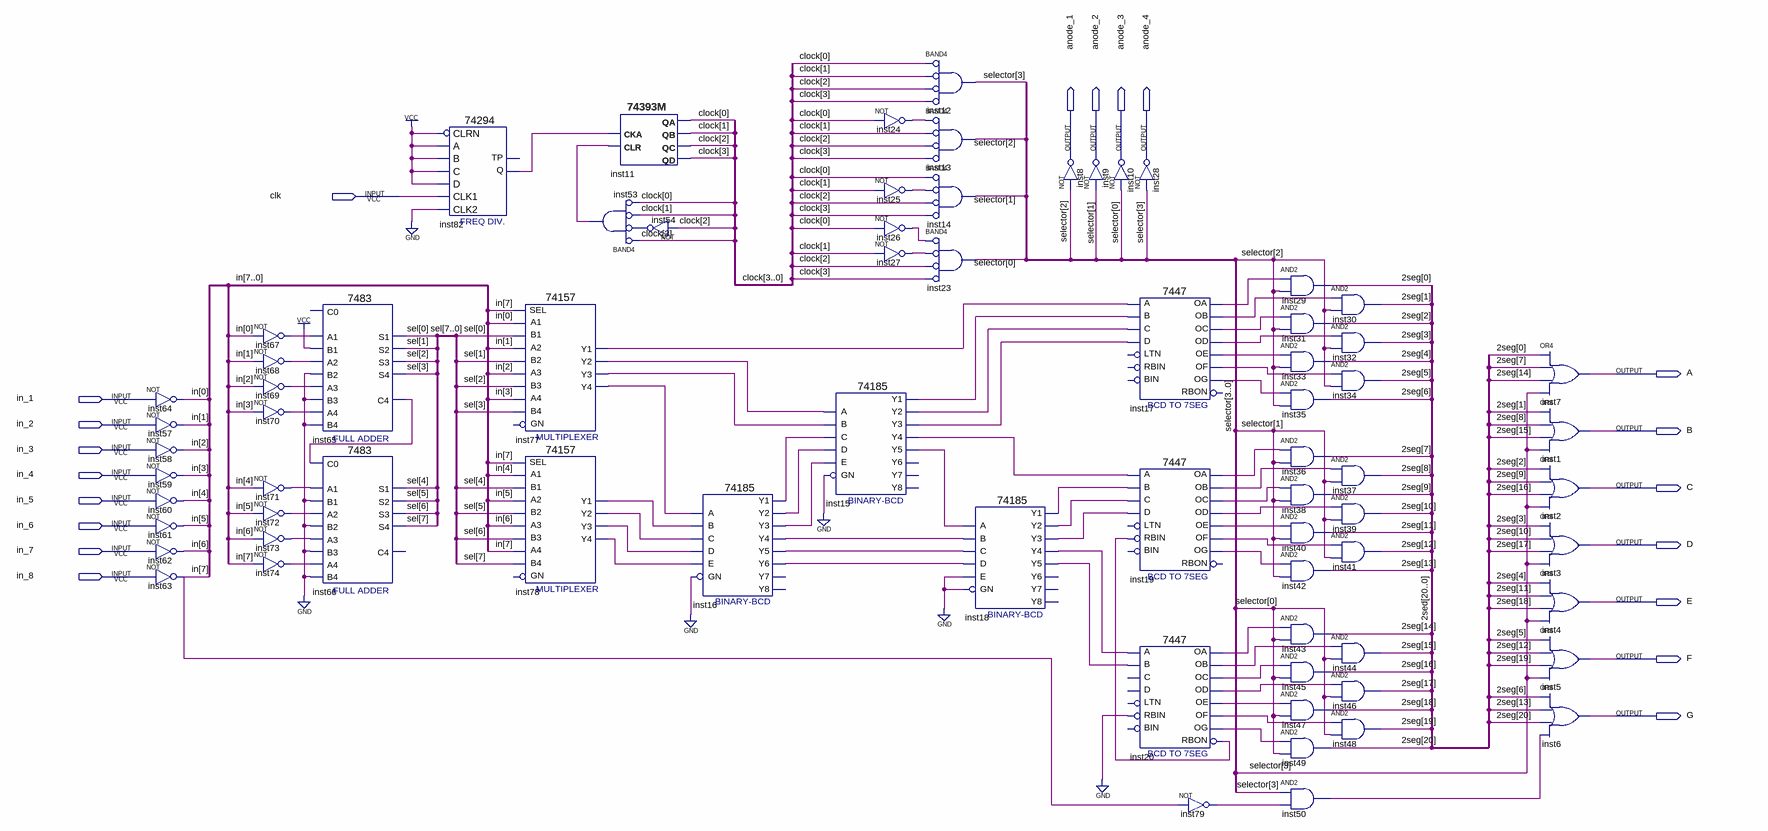
[diagram p0: schematic sheet]
// Quartus schematic tttttt.bdf as structural Verilog: 72 symbols, 20 pins
module tttttt (
  input  clk,
  input  in_1,
  input  in_2,
  input  in_3,
  input  in_4,
  input  in_5,
  input  in_6,
  input  in_7,
  input  in_8,
  output anode_1,
  output anode_2,
  output anode_3,
  output anode_4,
  output A,
  output B,
  output C,
  output D,
  output E,
  output F,
  output G
);

  wire inst15_y1, inst15_y2, inst15_y3, inst15_y4, inst15_y5, inst16_y1, inst16_y2, inst16_y3, inst16_y4,
       inst16_y5, inst16_y6, inst17_oa, inst17_ob, inst17_oc, inst17_od, inst17_oe, inst17_of, inst17_og,
       inst18_y1, inst18_y2, inst18_y3, inst18_y4, inst18_y5, inst19_oa, inst19_ob, inst19_oc, inst19_od,
       inst19_oe, inst19_of, inst19_og, inst20_oa, inst20_ob, inst20_oc, inst20_od, inst20_oe, inst20_of,
       inst20_og, inst20_rbon, inst24_out, inst25_out, inst26_out, inst27_out, inst50_out, inst53_out,
       inst54_out, inst65_c4, inst67_out, inst68_out, inst69_out, inst70_out, inst71_out, inst72_out,
       inst73_out, inst74_out, inst77_y1, inst77_y2, inst77_y3, inst77_y4, inst78_y1, inst78_y2, inst78_y3,
       inst78_y4, inst79_out, inst82_q;
  wire [3:0] clock, selector;
  wire [7:0] in, sel;
  wire [20:0] \2seg ;

  not inst64 (in[0], in_1);
  not inst57 (in[1], in_2);
  not inst58 (in[2], in_3);
  not inst59 (in[3], in_4);
  not inst60 (in[4], in_5);
  not inst61 (in[5], in_6);
  not inst62 (in[6], in_7);
  not inst63 (in[7], in_8);
  not inst67 (inst67_out, in[0]);
  not inst68 (inst68_out, in[1]);
  not inst69 (inst69_out, in[2]);
  not inst70 (inst70_out, in[3]);
  not inst71 (inst71_out, in[4]);
  not inst72 (inst72_out, in[5]);
  not inst73 (inst73_out, in[6]);
  not inst74 (inst74_out, in[7]);
  \7483  inst65 (
    .B4(1'b0), .A1(inst67_out), .A2(inst68_out), .B1(1'b1), .B2(1'b0), .A3(inst69_out), .B3(1'b0),
    .A4(inst70_out), .S3(sel[2]), .S4(sel[3]), .S2(sel[1]), .C4(inst65_c4), .S1(sel[0]));  // open: C0
  \7483  inst66 (
    .B4(1'b0), .C0(inst65_c4), .A1(inst71_out), .A2(inst72_out), .B1(1'b0), .B2(1'b0), .A3(inst73_out),
    .B3(1'b0), .A4(inst74_out), .S3(sel[6]), .S4(sel[7]), .S2(sel[5]), .S1(sel[4]));  // open: C4
  \74294  inst82 (
    .A(1'b1), .B(1'b1), .C(1'b1), .CLK1(clk), .CLK2(1'b0), .CLRN(1'b1), .D(1'b1), .Q(inst82_q));  // open: TP
  \74157  inst77 (
    .A1(in[0]), .B1(sel[0]), .SEL(in[7]), .B2(sel[1]), .A3(in[2]), .B3(sel[2]), .A2(in[1]), .B4(sel[3]),
    .A4(in[3]), .Y2(inst77_y2), .Y1(inst77_y1), .Y4(inst77_y4), .Y3(inst77_y3));  // open: GN
  \74157  inst78 (
    .A1(in[4]), .B1(sel[4]), .SEL(in[7]), .B2(sel[5]), .A3(in[6]), .B3(sel[6]), .A2(in[5]), .B4(sel[7]),
    .A4(in[7]), .Y2(inst78_y2), .Y1(inst78_y1), .Y4(inst78_y4), .Y3(inst78_y3));  // open: GN
  \74393M  inst11 (.CLR(inst53_out), .CKA(inst82_q), .QC(clock[2]), .QD(clock[3]), .QB(clock[1]), .QA(clock[0]));
  and inst53 (inst53_out, ~clock[3], ~inst54_out, ~clock[1], ~clock[0]);  // BAND4
  not inst54 (inst54_out, clock[2]);
  \74185  inst16 (
    .A(inst77_y4), .B(inst78_y1), .D(inst78_y3), .C(inst78_y2), .E(inst78_y4), .GN(1'b0), .Y1(inst16_y1),
    .Y3(inst16_y3), .Y2(inst16_y2), .Y5(inst16_y5), .Y4(inst16_y4), .Y6(inst16_y6));  // open: Y8, Y7
  \74185  inst15 (
    .A(inst77_y2), .B(inst77_y3), .D(inst16_y2), .C(inst16_y1), .E(inst16_y3), .GN(1'b0), .Y1(inst15_y1),
    .Y3(inst15_y3), .Y2(inst15_y2), .Y5(inst15_y5), .Y4(inst15_y4));  // open: Y6, Y8, Y7
  not inst24 (inst24_out, clock[0]);
  not inst25 (inst25_out, clock[1]);
  not inst26 (inst26_out, clock[0]);
  not inst27 (inst27_out, clock[1]);
  and inst12 (selector[3], ~clock[0], ~clock[1], ~clock[2], ~clock[3]);  // BAND4
  and inst13 (selector[2], ~inst24_out, ~clock[1], ~clock[2], ~clock[3]);  // BAND4
  and inst14 (selector[1], ~clock[0], ~inst25_out, ~clock[2], ~clock[3]);  // BAND4
  and inst23 (selector[0], ~inst26_out, ~inst27_out, ~clock[2], ~clock[3]);  // BAND4
  \74185  inst18 (
    .A(inst15_y5), .B(inst16_y4), .D(inst16_y6), .C(inst16_y5), .E(1'b0), .GN(1'b0), .Y1(inst18_y1),
    .Y3(inst18_y3), .Y2(inst18_y2), .Y5(inst18_y5), .Y4(inst18_y4));  // open: Y6, Y8, Y7
  not inst8 (anode_1, selector[2]);
  not inst9 (anode_2, selector[1]);
  not inst10 (anode_3, selector[0]);
  \7447  inst17 (
    .B(inst15_y1), .C(inst15_y2), .D(inst15_y3), .A(inst77_y1), .OB(inst17_ob), .OC(inst17_oc),
    .OE(inst17_oe), .OD(inst17_od), .OF(inst17_of), .OG(inst17_og), .OA(inst17_oa));  // open: LTN, RBIN, BIN, RBON
  \7447  inst19 (
    .B(inst18_y1), .C(inst18_y2), .D(inst18_y3), .RBIN(inst20_rbon), .A(inst15_y4), .OB(inst19_ob),
    .OC(inst19_oc), .OE(inst19_oe), .OD(inst19_od), .OF(inst19_of), .OG(inst19_og), .OA(inst19_oa));  // open: LTN, BIN, RBON
  \7447  inst20 (
    .B(inst18_y5), .RBIN(1'b0), .A(inst18_y4), .OB(inst20_ob), .OC(inst20_oc), .OE(inst20_oe),
    .OD(inst20_od), .OF(inst20_of), .OG(inst20_og), .OA(inst20_oa), .RBON(inst20_rbon));  // open: LTN, C, D, BIN
  not inst28 (anode_4, selector[3]);
  not inst79 (inst79_out, in[7]);
  and inst29 (\2seg [0], inst17_oa, selector[2]);
  and inst31 (\2seg [2], inst17_oc, selector[2]);
  and inst33 (\2seg [4], inst17_oe, selector[2]);
  and inst35 (\2seg [6], inst17_og, selector[2]);
  and inst36 (\2seg [7], inst19_oa, selector[1]);
  and inst38 (\2seg [9], inst19_oc, selector[1]);
  and inst40 (\2seg [11], inst19_oe, selector[1]);
  and inst42 (\2seg [13], inst19_og, selector[1]);
  and inst43 (\2seg [14], inst20_oa, selector[0]);
  and inst45 (\2seg [16], inst20_oc, selector[0]);
  and inst47 (\2seg [18], inst20_oe, selector[0]);
  and inst49 (\2seg [20], inst20_og, selector[0]);
  and inst50 (inst50_out, selector[3], inst79_out);
  and inst30 (\2seg [1], inst17_ob, selector[2]);
  and inst32 (\2seg [3], inst17_od, selector[2]);
  and inst34 (\2seg [5], inst17_of, selector[2]);
  and inst37 (\2seg [8], inst19_ob, selector[1]);
  and inst39 (\2seg [10], inst19_od, selector[1]);
  and inst41 (\2seg [12], inst19_of, selector[1]);
  and inst44 (\2seg [15], inst20_ob, selector[0]);
  and inst46 (\2seg [17], inst20_od, selector[0]);
  and inst48 (\2seg [19], inst20_of, selector[0]);
  or inst7 (A, \2seg [0], \2seg [7], \2seg [14], selector[3]);
  or inst1 (B, \2seg [1], \2seg [8], \2seg [15], selector[3]);
  or inst2 (C, \2seg [2], \2seg [9], \2seg [16], selector[3]);
  or inst3 (D, \2seg [3], \2seg [10], \2seg [17], selector[3]);
  or inst4 (E, \2seg [4], \2seg [11], \2seg [18], selector[3]);
  or inst5 (F, \2seg [5], \2seg [12], \2seg [19], selector[3]);
  or inst6 (G, \2seg [6], \2seg [13], \2seg [20], inst50_out);
endmodule
